# Altium project RaspberryPi_Pico.PrjPcb
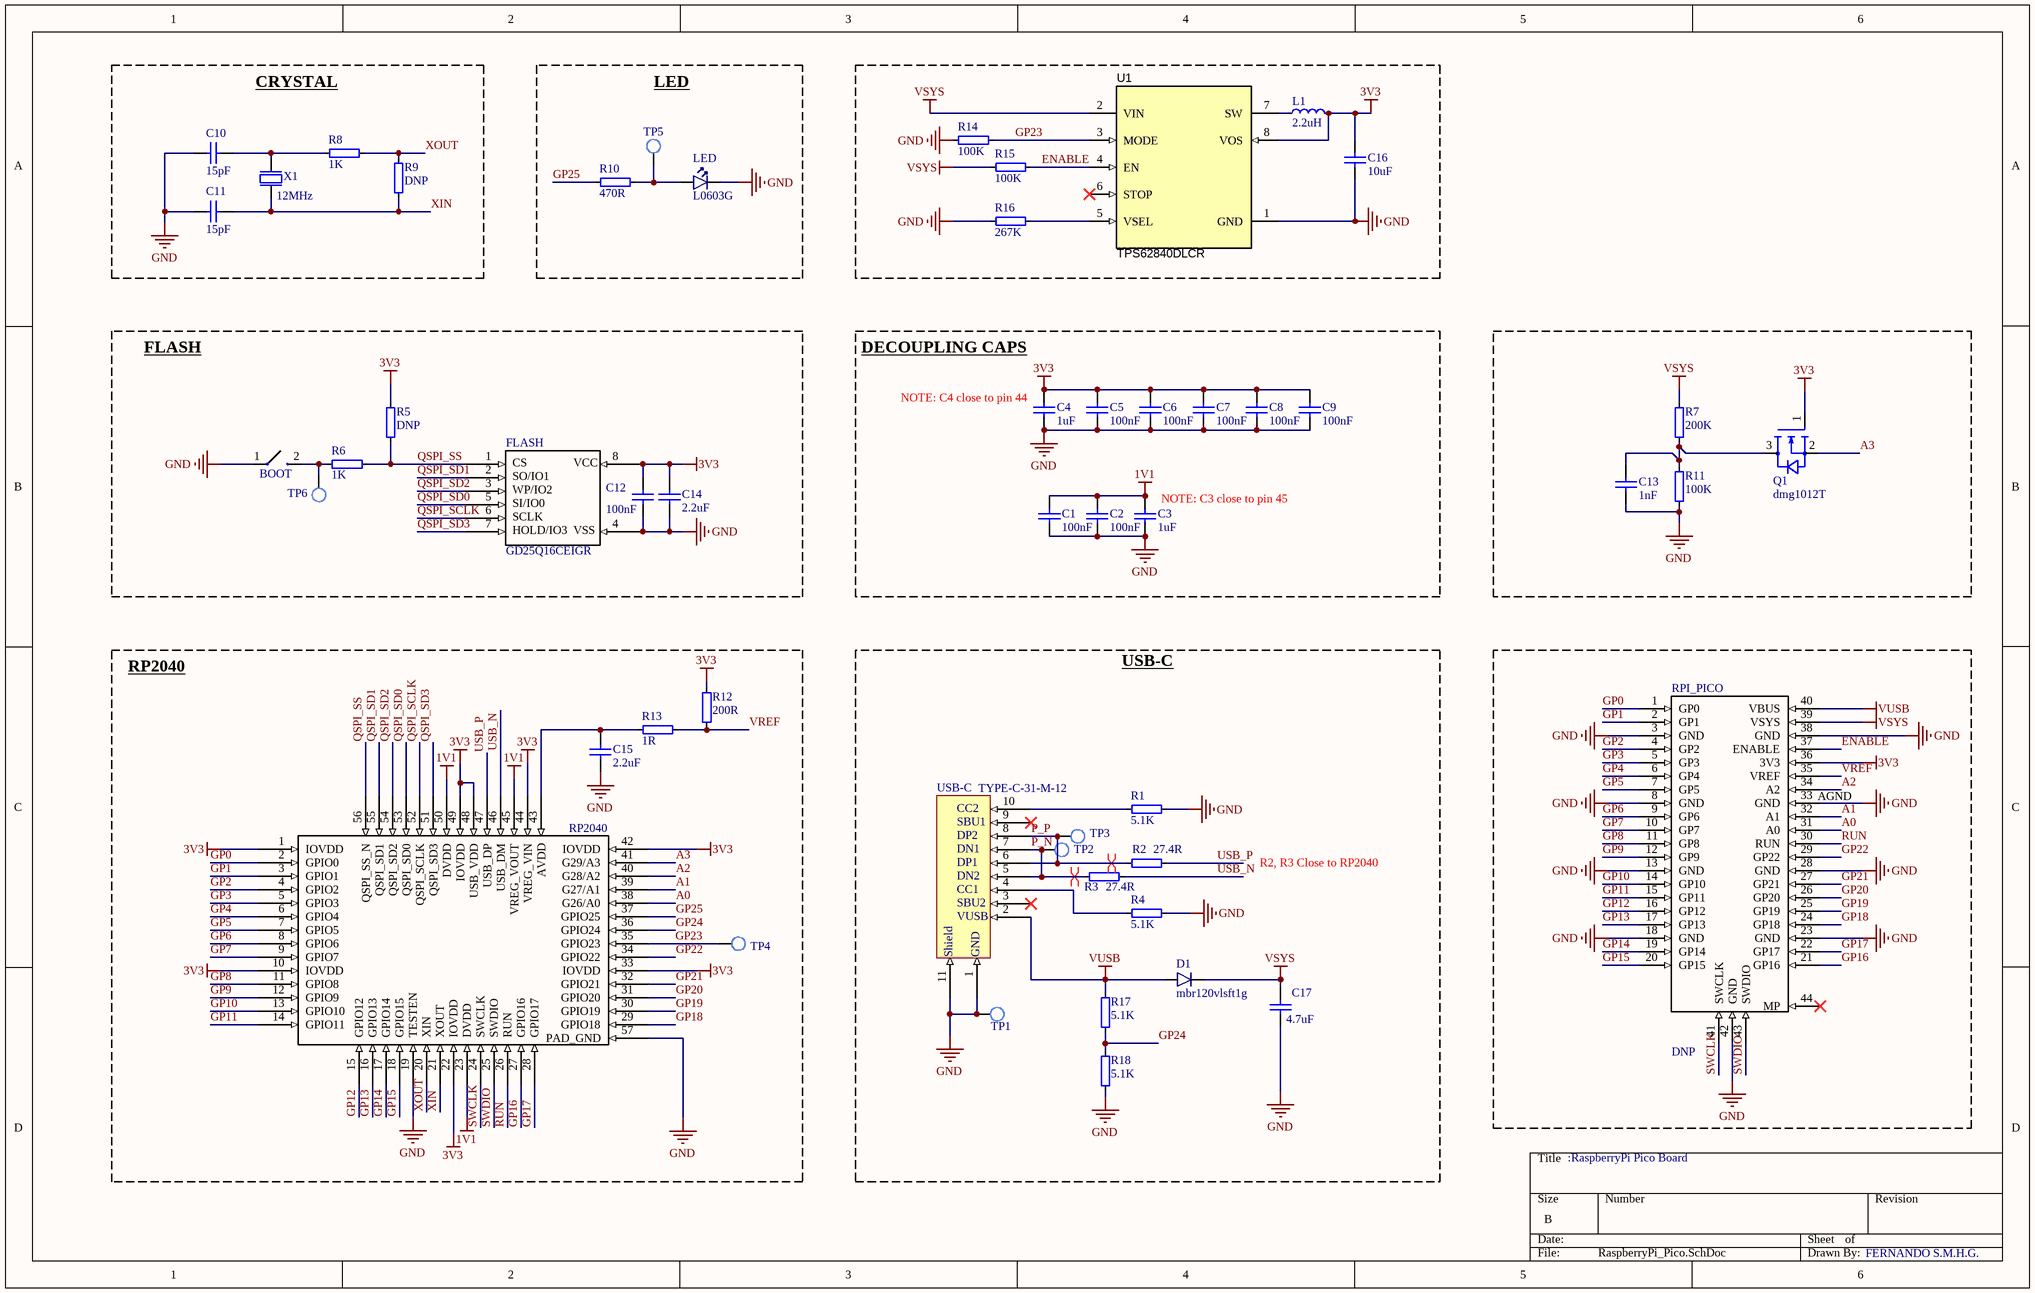
[diagram p0: RaspberryPi_Pico.SchDoc]
1 sheet, 52 parts. Net scope: global (net labels, ports and power ports of the same name join across sheets).
Board file: RaspberryPi_Pico.PcbDoc

## Sheet RaspberryPi_Pico.SchDoc: RPI PICO
size B; DrawnBy: Sindre Hovland; Organization: MIT License; Revision: Untested; SheetNumber: 1; SheetTotal: 1

### Parts
BOOT  EVP-AA002K  [MiniSwitch]  (value not drawn)
C1  100nF  [C0402]
C2  100nF  [C0402]
C3  1uF  [C0402]
C4  1uF  [C0402]
C5  100nF  [C0402]
C6  100nF  [C0402]
C7  100nF  [C0402]
C8  100nF  [C0402]
C9  100nF  [C0402]
C10  15pF  [C0402]
C11  15pF  [C0402]
C12  100nF  [C0402]
C13  1nF  [C0402]
C14  2.2uF  [C0603]
C15  2.2uF  [C0603]
C16  10uF  [C0603]
C17  4.7uF  [C0603]
D1  mbr120vlsft1g  [SOD-123]
FLASH  GD25Q16CEIGR  [GD25Q16CEIGR]
L1  2.2uH  [IND0805]
LED  L0603G  [LED_0603]
Q1  dmg1012T  [SOTFL3P40_120X120X55L30X32N]
R1  5.1K  [RES0402]
R2  27.4R  [RES0402]
R3  27.4R  [RES0402]
R4  5.1K  [RES0402]
R5  DNP  [RES0402]
R6  1K  [RES0402]
R7  200K  [RES0402]
R8  1K  [RES0402]
R9  DNP  [RES0402]
R10  470R  [RES0603R]
R11  100K  [RES0402]
R12  200R  [RES0402]
R13  1R  [RES0402]
R14  100K  [RES0402]
R15  100K  [RES0402]
R16  267K  [RES0402]
R17  5.1K  [RES0402]
R18  5.1K  [RES0402]
RP2040  RP2040  [RP2040]  (value not drawn)
RPI_PICO  DNP  [RPI PICO]
TP1  DNP  [TP_SMD_1.0mm]  (value not drawn)
TP2  DNP  [TP_SMD_1.0mm]  (value not drawn)
TP3  DNP  [TP_SMD_1.0mm]  (value not drawn)
TP4  DNP  [TP_SMD_1.0mm]  (value not drawn)
TP5  DNP  [TP_SMD_1.0mm]  (value not drawn)
TP6  DNP  [TP_SMD_1.0mm]  (value not drawn)
U1  TPS62840DLCR  [TPS62840]
USB-C  TYPE-C-31-M-12  [TYPE-C-31-M-12]
X1  12MHz  [XTAL_2016]

### Blocks framed on the sheet
CRYSTAL: C10 C11 R8 R9 X1
LED: LED R10 TP5
FLASH: BOOT C12 C14 FLASH R5 R6 TP6
DECOUPLING CAPS: C1-C9
RP2040: C15 R12 R13 RP2040 TP4
USB-C: C17 D1 R1-R4 R17 R18 TP1-TP3 USB-C
AGND: RPI_PICO

### Nets
1V1: C1.2 C2.2 C3.2 RP2040.23(DVDD) RP2040.45(VREG_VOUT) RP2040.50(DVDD)
3V3: C4.2 C5.2 C6.2 C7.2 C8.2 C9.2 C12.2 C14.2 C16.2 FLASH.8 L1.2 Q1.1(G) R5.2 R12.2 RP2040.1(IOVDD) RP2040.10(IOVDD) RP2040.22(IOVDD) RP2040.33(IOVDD) RP2040.42(IOVDD) RP2040.44(VREG_VIN) RP2040.48(USB_VDD) RP2040.49(IOVDD) RPI_PICO.36(3V3) U1.8(VOS)
GND: BOOT.1 C1.1 C2.1 C3.1 C4.1 C5.1 C6.1 C7.1 C8.1 C9.1 C10.2 C11.2 C12.1 C13.1 C14.1 C15.1 C16.1 C17.1 FLASH.4 LED.1(C) R1.1 R4.2 R11.1 R14.2 R16.1 R18.1 RP2040.19(TESTEN) RP2040.57(PAD_GND) RPI_PICO.3(GND) RPI_PICO.8(GND) RPI_PICO.13(GND) RPI_PICO.18(GND) RPI_PICO.23(GND) RPI_PICO.28(GND) RPI_PICO.33(GND) RPI_PICO.38(GND) RPI_PICO.42(GND) TP1.1 U1.1(GND) USB-C.1 USB-C.11 X1.2(GND) X1.4(GND)
VSYS: C17.2 D1.2(C) R7.2 R15.2 RPI_PICO.39(VSYS) U1.2(VIN)
VUSB: D1.1(A) R17.2 RPI_PICO.40(VBUS) USB-C.2
A0: RP2040.38(G26/A0) RPI_PICO.31(A0)
A1: RP2040.39(G27/A1) RPI_PICO.32(A1)
A2: RP2040.40(G28/A2) RPI_PICO.34(A2)
A3: Q1.2(S) RP2040.41(G29/A3)
ENABLE: R15.1 RPI_PICO.37(ENABLE) U1.4(EN)
GP0: RP2040.2(GPIO0) RPI_PICO.1(GP0)
GP1: RP2040.3(GPIO1) RPI_PICO.2(GP1)
GP2: RP2040.4(GPIO2) RPI_PICO.4(GP2)
GP3: RP2040.5(GPIO3) RPI_PICO.5(GP3)
GP4: RP2040.6(GPIO4) RPI_PICO.6(GP4)
GP5: RP2040.7(GPIO5) RPI_PICO.7(GP5)
GP6: RP2040.8(GPIO6) RPI_PICO.9(GP6)
GP7: RP2040.9(GPIO7) RPI_PICO.10(GP7)
GP8: RP2040.11(GPIO8) RPI_PICO.11(GP8)
GP9: RP2040.12(GPIO9) RPI_PICO.12(GP9)
GP10: RP2040.13(GPIO10) RPI_PICO.14(GP10)
GP11: RP2040.14(GPIO11) RPI_PICO.15(GP11)
GP12: RP2040.15(GPIO12) RPI_PICO.16(GP12)
GP13: RP2040.16(GPIO13) RPI_PICO.17(GP13)
GP14: RP2040.17(GPIO14) RPI_PICO.19(GP14)
GP15: RP2040.18(GPIO15) RPI_PICO.20(GP15)
GP16: RP2040.27(GPIO16) RPI_PICO.21(GP16)
GP17: RP2040.28(GPIO17) RPI_PICO.22(GP17)
GP18: RP2040.29(GPIO18) RPI_PICO.24(GP18)
GP19: RP2040.30(GPIO19) RPI_PICO.25(GP19)
GP20: RP2040.31(GPIO20) RPI_PICO.26(GP20)
GP21: RP2040.32(GPIO21) RPI_PICO.27(GP21)
GP22: RP2040.34(GPIO22) RPI_PICO.29(GP22)
GP23: R14.1 RP2040.35(GPIO23) TP4.1 U1.3(MODE)
GP24: R17.1 R18.2 RP2040.36(GPIO24)
GP25: R10.1 RP2040.37(GPIO25)
P_N: R3.2 TP2.1 USB-C.5 USB-C.7
P_P: R2.2 TP3.1 USB-C.6 USB-C.8
QSPI_SCLK: FLASH.6 RP2040.52(QSPI_SCLK)
QSPI_SD0: FLASH.5 RP2040.53(QSPI_SD0)
QSPI_SD1: FLASH.2 RP2040.55(QSPI_SD1)
QSPI_SD2: FLASH.3 RP2040.54(QSPI_SD2)
QSPI_SD3: FLASH.7 RP2040.51(QSPI_SD3)
QSPI_SS: FLASH.1 R5.1 R6.2 RP2040.56(QSPI_SS_N)
RUN: RP2040.26(RUN) RPI_PICO.30(RUN)
SWCLK: RP2040.24(SWCLK) RPI_PICO.41(SWCLK)
SWDIO: RP2040.25(SWDIO) RPI_PICO.43(SWDIO)
USB_N: R3.1 RP2040.46(USB_DM)
USB_P: R2.1 RP2040.47(USB_DP)
VREF: R12.1 R13.1 RPI_PICO.35(VREF)
XIN: C11.1 R9.1 RP2040.21(XOUT) X1.1(inp)
XOUT: R8.2 R9.2 RP2040.20(XIN)
NetBOOT_2: BOOT.2 R6.1 TP6.1
NetC10_1: C10.1 R8.1 X1.3(out)
NetC13_2: C13.2 Q1.3(D) R7.1 R11.2
NetC15_2: C15.2 R13.2 RP2040.43(AVDD)
NetL1_1: L1.1 U1.7(SW)
NetLED_2: LED.2(A) R10.2 TP5.1
NetR1_2: R1.2 USB-C.10
NetR4_1: R4.1 USB-C.4
NetR16_2: R16.2 U1.5(VSEL)

Not connected (* = marked no-connect by the designer): RPI_PICO 44(MP)*; U1 6(STOP)*; USB-C 3* 9*

### Layout directives
differential pair: P_N, P_P

### Notes on the sheet
- (near C4) NOTE: C4 close to pin 44
- (near C3) NOTE: C3 close to pin 45
- R2, R3 Close to RP2040
- :RaspberryPi Pico Board
- FERNANDO S.M.H.G.
- (in symbol Flash SPI) CS; VCC; SO/IO1; WP/IO2; SI/IO0; SCLK; HOLD/IO3; VSS
- (in symbol USB-C) CC2; SBU1; DP2; DN1; DP1; DN2; CC1; SBU2; VUSB; Shield; GND

### Library data of the parts
BOOT = SwitchMini: EVPAA002K = 1.0 N, EVPAAU02Q = 7.0 N; Supplier 1: Digi-Key; Supplier Part Number 1: P13347SCT-ND
C1-C17 = CAP: Capacitor; Value: 100pF; Published: 8-Jun-2000; Revision: July-2002: Re-released for DXP Platform.; Publisher: Altium Limited
D1 = Diode: Switch-mode Schottky / Power Rectifier / 250 V, 40 A
FLASH = Flash SPI: Flash SPI 16Mb = 2 MB; Supplier 1: Mouser; Supplier Part Number 1: 363-GD25Q16CEIGR
L1 = IND: Inductor; Part Number: FB0402-120R@100M-500mA; Manufacturer: Murata; Manufacturer Part Number: BLM15AG121SN1D; Part number IPS: N.A.; Value: 120R/0.55A; Note: Chip EMIFIL Inductor Type Chip Ferrite Bead; Artikkelnr Noca: 33029317; Footprint Doc: 0402; LatestRevisionDate: 2014-01-10; Pin Count: 2; Publisher: Nordic Semiconductor; Published: 2011-11-14; ComponentLink1URL: *; ComponentLink1Description: Datasheet; ComponentLink2URL: *; ComponentLink2Description: Supplier link; HelpURL: http://search.murata.co.jp/Ceramy/image/img/PDF/ENG/L0110S0100BLM15A_SN.pdf
LED = D:LED: LED, Green, 0603, 570nm, Vf=1.7V, 2.24..5.6mcd, - 40 to +100°C; Part Number: LG L29K Smartled Green; Manufacturer: Osram; Manufacturer Part Number: LG L29K-G2J1-24-Z; Part number IPS: N.A.; Note: 2.24..5.6 mcd, Vfmin=1.7V; Artikkelnr Noca: 13019147; Footprint Doc: 0603; LatestRevisionDate: 2017-08-21; Pin Count: 2; Publisher: Nordic Semiconductor; Published: 2014-10-28; Value: L0603G; ComponentLink1URL: *; ComponentLink1Description: Datasheet; ComponentLink2URL: *; ComponentLink2Description: Supplier link; HelpURL: http://www.osram-os.com/Graphics/XPic2/00077107_0.pdf; Supplier 1: Digi-Key; Supplier Part Number 1: 475-2709-1-ND; Supplier 2: Mouser; Supplier Part Number 2: 720-LGL29KG2J124Z
Q1 = Transistor: N-Channel 20V 100mA _Ta_ 150mW _Ta_ Surface Mount VMT3; MF: Rohm; MP: RUM001L02T2CL; Value: *; SnapEDA_Link: https://www.snapeda.com/parts/RUM001L02T2CL/Rohm/view-part/531428/?ref=snap; Digi-Key_Part_Number: RUM001L02T2CLCT-ND; Digi-Key_Purchase_URL: https://www.digikey.com/product-detail/en/rohm-semiconductor/RUM001L02T2CL/RUM001L02T2CLCT-ND/4571412?utm_source=snapeda&utm_medium=aggregator&utm_campaign=symbol; Package: SOT-723 Rohm
R1-R18 = RES: Resistor, ±5%, 0.05W; Part Number: R0201-0R; Part number IPS: 00000003245; Value: 0R; Note: Chip Res 5%; Artikkelnr Noca: N.A.; Manufacturer: *; Manufacturer Part Number: *; ComponentLink1URL: *; ComponentLink1Description: Datasheet; ComponentLink2URL: *; ComponentLink2Description: Supplier link; HelpURL: *; Footprint Doc: 0201; LatestRevisionDate: 2017-11-09; Pin Count: 2; Publisher: Nordic Semiconductor; Published: 2014-11-13; Supplier 1: *; Supplier Part Number 1: *; Supplier 2: *; Supplier Part Number 2: *
RP2040 = RP2040: RP2040 First MCU from RPI
RPI_PICO = RPI_PICO
TP1-TP6 = TP
U1 = TPS62840: Ultra low IQ Step Down Converter, DLC0008A (VSON-HR-8); Alternate Manufacturer: Texas Instruments; SizeAreaWB_mm2: 7.5; SizeZ_mm: 1; SizeX_mm: 1.5; SizeY_mm: 2; SizeArea_mm2: 3; CompType: IC; AEC Qualified: N; AEC Category: Q200; ComponentLink1URL: http://www.ti.com/lit/ds/symlink/tps62840.pdf; PackageDescription: VSON-HR-8; MountType: SMT; ComponentLink2URL: http://www.ti.com/product/tps62840; ComponentLink3Description: Online Datasheet; ComponentLink2Description: Product Folder; Manufacturer: Texas Instruments; ComponentLink3URL: http://www.ti.com/product/tps62840/datasheet; PackageReference: DLC0008A; ComponentLink1Description: Datasheet Link; Operating Temperature Range: -40 to 125 C; Supplier 1: Mouser; Supplier Part Number 1: 595-TPS62840DLCR; PartNumber: TPS62840DLCR
USB-C = USB-C: USB C connector; ComponentLink1Description: LCSC; ComponentLink1URL: https://lcsc.com/product-detail/USB-Connectors_Korean-Hroparts-Elec-TYPE-C-31-M-12_C165948.html
X1 = XTAL_SMD2016: XTAL SMD 2016, 32MHz, Cl=8pF, Total Tol: ±40ppm; Part Number: XTAL_SMD2016_32MHz_8pF_General; LatestRevisionDate: 2016-08-19; Pin Count: 4; Publisher: Nordic Semiconductor; Published: 2016-08-19; Value: 32MHz; Footprint Doc: XTAL_2016; Manufacturer: *; Manufacturer Part Number: *

## Assembly variants
Default: not fitted R5 R9 RPI_PICO TP1 TP2 TP3 TP4 TP5 TP6